# EAGLE design Mono Crossover R1 (EAGLE 9.6.2)
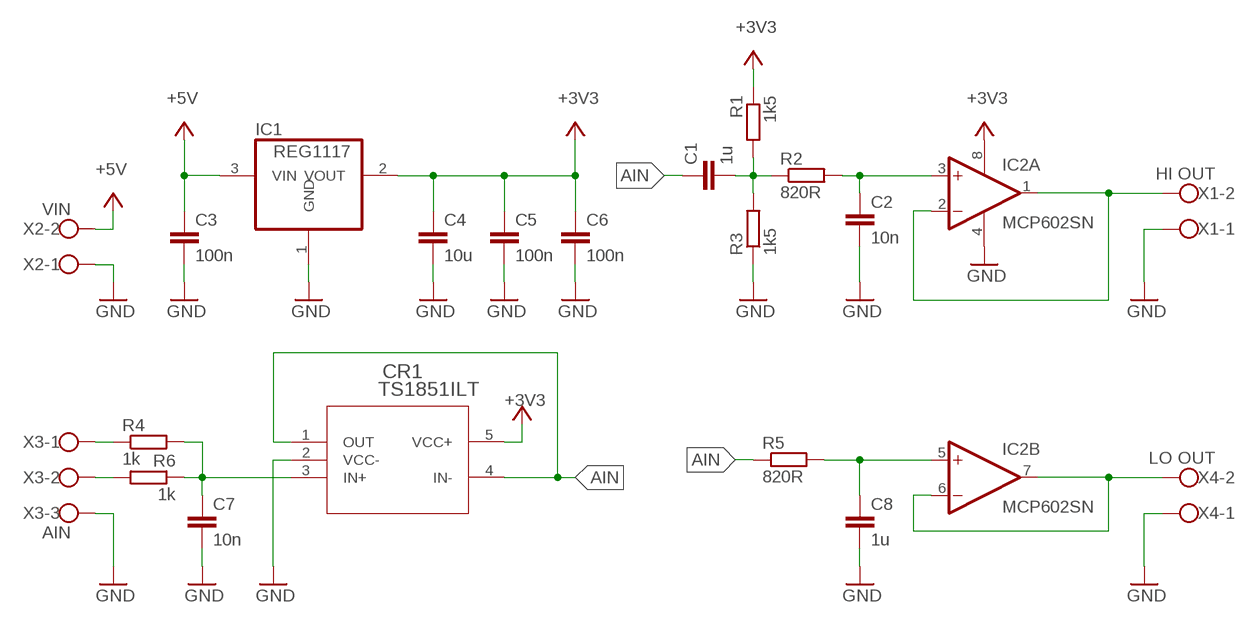
[diagram p0: schematic, sheet 1]

## Parts
C1  1u  C-EUC0805  [C0805]
C2  10n  C-EUC0603  [C0603]
C3  100n  C-EUC0603  [C0603]
C4  10u  C-EUC1206  [C1206]
C5  100n  C-EUC0603  [C0603]
C6  100n  C-EUC0603  [C0603]
C7  10n  C-EUC0603  [C0603]
C8  1u  C-EUC0805  [C0805]
CR1  TS1851ILT  [SOT23-5L_STM]
IC1  REG1117  [SOT223]
IC2  MCP602SN  [SO08]
R1  1k5  R-EU_R0805  [R0805]
R2  820R  R-EU_R1206  [R1206]
R3  1k5  R-EU_R0805  [R0805]
R4  1k  R-EU_R0603  [R0603]
R5  820R  R-EU_R1206  [R1206]
R6  1k  R-EU_R0603  [R0603]
X1  HI OUT  W237-102  [W237-102]
X2  VIN  W237-102  [W237-102]
X3  AIN  W237-103  [W237-103]
X4  LO OUT  W237-102  [W237-102]

## Nets
+3V3: C4.1 C5.1 C6.1 CR1.5(VCC+) IC1.2(VOUT) IC2.8(P:V+) R1.1
+5V: C3.1 IC1.3(VIN) X2.2
AIN: C1.1 CR1.1(OUT) CR1.4(IN-) R5.1
GND: C2.2 C3.2 C4.2 C5.2 C6.2 C7.2 C8.2 CR1.2(VCC-) IC1.1(GND) IC2.4(P:V-) R3.1 X1.1 X2.1 X3.3 X4.1
HI_OUT: IC2.1(A:OUT) IC2.2(A:-IN) X1.2
LO_OUT: IC2.6(B:-IN) IC2.7(B:OUT) X4.2
N$1: R4.1 X3.1
N$2: R6.2 X3.2
N$3: C2.1 IC2.3(A:+IN) R2.2
N$4: C1.2 R1.2 R2.1 R3.2
N$5: C8.1 IC2.5(B:+IN) R5.2
N$6: C7.1 CR1.3(IN+) R4.2 R6.1

## Library data of the parts
C1-C8 = rcl:C-EU: CAPACITOR, European symbol; SPICEPREFIX: C
CR1 = user:TS1851ILT; COPYRIGHT: Copyright (C) 2022 Ultra Librarian. All rights reserved.; MANUFACTURER_PART_NUMBER: TS1851ILT; MFR_NAME: STMicroelectronics
IC1 = burr-brown:REG1117: 800mA and 1A Low Dropout (LDO) Positive Regulator 1.8V, 2.5V, 2.85V, 3.3V, 5V, and Adj; MPN: REG1117; OC_FARNELL: 1097566; OC_NEWARK: 14P6981
IC2 = linear:MCP602: Single Op Amp 2.7V to 6.0V Single Supply CMOS Source: http://ww1.microchip.com/downloads/en/DeviceDoc/21314g.pdf
R1-R6 = rcl:R-EU_: RESISTOR, European symbol; SPICEPREFIX: R
X1 X2 X4 = con-wago-500:W237-102: WAGO SCREW CLAMP; MPN: 237-102; OC_FARNELL: unknown; OC_NEWARK: 70K9898
X3 = con-wago-500:W237-103: WAGO SCREW CLAMP; MPN: 237-103; OC_FARNELL: unknown; OC_NEWARK: 18M7116

## Board
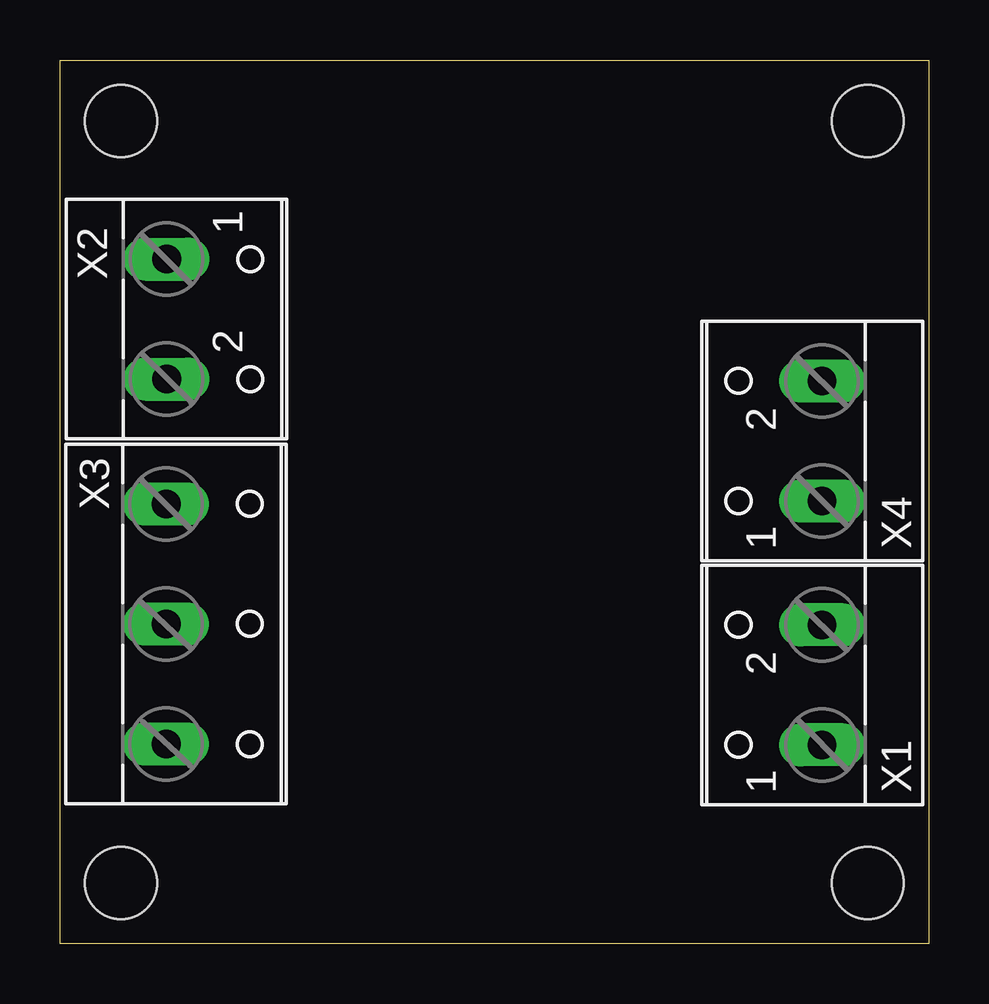
[diagram p1: board, top side]
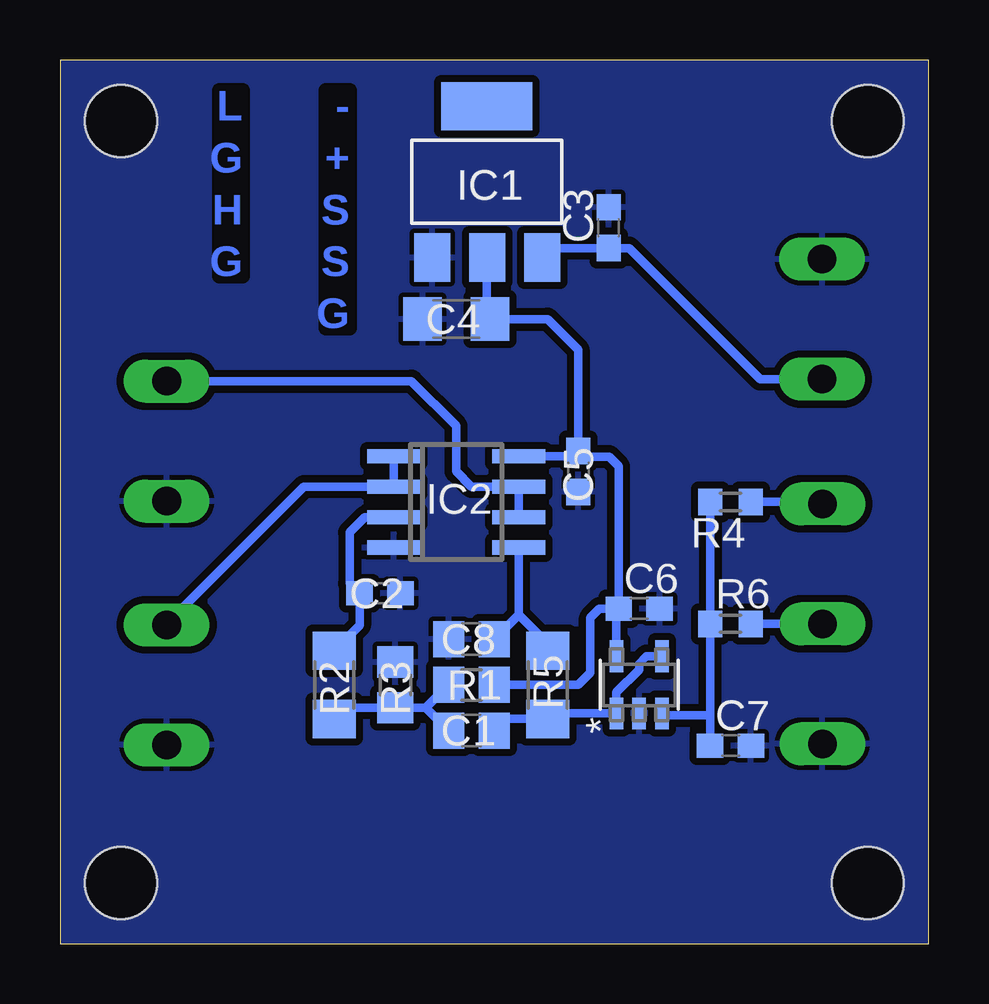
[diagram p2: board, bottom side, seen from below]

Size 36.2 x 36.83 mm. Coordinates in mm from the lower left corner, seen from the top.
Outline: 0,36.83 36.2,36.83 36.2,0 0,0 0,36.83
Copper layers (1*16): Top 0.035mm / dielectric 1.5mm / Bottom 0.035mm
Design rules "default *": minimum track width 0.15mm, minimum drill 0.35mm, track to track 0.3mm, track to pad 0.2mm, pad to pad 0.2mm, via to via 0.2mm, smd to smd 0.2mm, copper to edge 0.002540625mm, drill to drill 6mil, minimum pad ring 10mil, minimum via ring 8mil, stop-mask expansion 4mil, vias tented up to drill 0mil, thermal gap 0.2mm
Holes 3 mm at 2.54,34.29 33.66,34.29 33.66,2.54 2.54,2.54

### Footprints (pad centres in the part's own frame; a part is rotated, then mirrored left to right if it is on the bottom)
C0805 = smd 1.3 x 1.5: 1 -0.95,0; 2 0.95,0
C0603 = smd 1.1 x 1: 1 -0.85,0; 2 0.85,0
C1206 = smd 1.6 x 1.8: 1 -1.4,0; 2 1.4,0
SOT23-5L_STM = smd 1.321 x 0.559: 1 -1.194,0.95; 2 -1.194,0; 3 -1.194,-0.95; 4 1.194,-0.95; 5 1.194,0.95
SOT223 = smd 1.499 x 2.007: 1 -2.261,-3.15; 2 0.025,-3.15; 3 2.311,-3.15 | smd 3.81 x 2.007: 4 0,3.15
SO08 = smd 0.6 x 2.2: 1 -1.905,-2.6; 2 -0.635,-2.6; 3 0.635,-2.6; 4 1.905,-2.6; 5 1.905,2.6; 6 0.635,2.6; 7 -0.635,2.6; 8 -1.905,2.6
R0805 = smd 1.3 x 1.5: 1 -0.95,0; 2 0.95,0
R1206 = smd 1.6 x 1.803: 1 -1.422,0; 2 1.422,0
R0603 = smd 1 x 1.1: 1 -0.85,0; 2 0.85,0
W237-102 = drill 1.194 long: 1 -2.5,-1.27; 2 2.5,-1.27
W237-103 = drill 1.194 long: 1 -5,-1.29; 2 0,-1.29; 3 5,-1.29

### Placement (x,y rotation side)
C1  19.05,8.89 180 bottom
C2  22.86,14.61 0 bottom
C3  13.34,29.84 90 bottom
C4  19.69,26.04 180 bottom
C5  14.61,19.69 270 bottom
C6  12.07,13.97 0 bottom
C7  8.26,8.26 0 bottom
C8  19.05,12.7 180 bottom
CR1  12.07,10.8 90 bottom
IC1  18.41,31.75 0 bottom
IC2  19.69,18.41 270 bottom
R1  19.05,10.8 180 bottom
R2  24.77,10.8 90 bottom
R3  22.23,10.8 270 bottom
R4  8.26,18.41 180 bottom
R5  15.88,10.8 90 bottom
R6  8.26,13.34 0 bottom
X1  30.48,10.8 90 top
X2  5.71,26.04 270 top
X3  5.71,13.34 270 top
X4  30.48,20.95 90 top

### Tracks (layer width: path | path; a pad name or v marks a point on that pad's centre or on a via)
+3V3
  Bottom 0.35: IC1.2 18.41,28.58 18.41,26.16 C4.1 15.88,26.04 14.61,24.77 C5.1 14.71,20.43 | CR1.5 13.02,13.87 | 13.02,13.87 C6.1 12.92,19.9 13.32,20.3 14.84,20.3 14.71,20.43 | 14.71,20.43 14.82,20.32 IC2.8 | R1.1 14.61,10.8 14.1,11.3 14.1,13.59 13.72,13.97 13.12,13.97 13.02,13.87
+5V
  Bottom 0.35: IC1.3 15.71,29 C3.1 12.48,29 7.03,23.54 X2.2
AIN
  Bottom 0.35: CR1.4 11.76,11.99 12.07,11.68 12.07,11.43 13.02,10.48 CR1.1 15.65,9.6 R5.1 17.78,9.37 18.1,9.05 C1.1
GND
  pour Bottom: -0.63,37.47 36.83,37.47 36.83,-0.63 -0.63,-0.63
HI_OUT
  Bottom 0.35: IC2.1 IC2.2 26.04,19.05 31.75,13.34 X1.2
LO_OUT
  Bottom 0.35: IC2.6 IC2.7 19.05,19.05 19.69,19.69 19.69,21.59 21.55,23.45 X4.2
N$1
  Bottom 0.35: X3.1 4.51,18.41 R4.1
N$2
  Bottom 0.35: R6.2 X3.2
N$3
  Bottom 0.35: C2.1 23.84,14.73 | R2.2 23.71,13.27 C2.1 | IC2.3 23.5,17.78 24.13,17.15 24.13,15.02 C2.1
N$4
  Bottom 0.35: R2.1 24.29,9.85 R3.2 21.27,9.85 | 21.27,9.85 20.95,9.85 C1.2 | 21.27,9.85 20.95,9.85 R1.2
N$5
  Bottom 0.35: 18.1,12.74 C8.1 17.09,13.72 | 17.09,13.72 IC2.5 | R5.2 15.88,12.51 17.09,13.72
N$6
  Bottom 0.35: R4.2 R6.1 9.11,12.07 9.11,9.53 | C7.1 9.11,9.53 | CR1.3 11.04,9.53 9.11,9.53

### Text on the board
Bottom: - / + / S / S / G | L / G / H / G